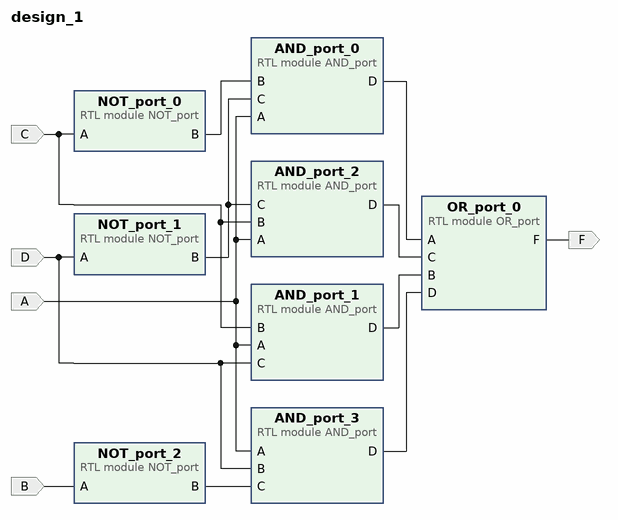
[diagram p0: block diagram of the top level]
# Vivado block design design_1, xc7z020clg400-1, Vivado 2023.1
create_bd_design design_1

create_bd_port -dir I A
create_bd_port -dir I C
create_bd_port -dir I D
create_bd_port -dir I B
create_bd_port -dir O F

create_bd_cell -type module -reference AND_port AND_port_0
create_bd_cell -type module -reference AND_port AND_port_1
create_bd_cell -type module -reference AND_port AND_port_2
create_bd_cell -type module -reference AND_port AND_port_3
create_bd_cell -type module -reference NOT_port NOT_port_0
create_bd_cell -type module -reference NOT_port NOT_port_1
create_bd_cell -type module -reference NOT_port NOT_port_2
create_bd_cell -type module -reference OR_port OR_port_0

# ---- connections ----

connect_bd_net [get_bd_pins AND_port_0/D] [get_bd_pins OR_port_0/A]
connect_bd_net [get_bd_pins AND_port_1/D] [get_bd_pins OR_port_0/B]
connect_bd_net [get_bd_pins AND_port_2/D] [get_bd_pins OR_port_0/C]
connect_bd_net [get_bd_pins AND_port_3/D] [get_bd_pins OR_port_0/D]
connect_bd_net -net A_0_2 [get_bd_ports B] [get_bd_pins NOT_port_2/A]
connect_bd_net [get_bd_ports A] [get_bd_pins AND_port_0/A] [get_bd_pins AND_port_1/A] [get_bd_pins AND_port_2/A] [get_bd_pins AND_port_3/A]
connect_bd_net [get_bd_ports C] [get_bd_pins NOT_port_0/A] [get_bd_pins AND_port_1/B] [get_bd_pins AND_port_2/B]
connect_bd_net [get_bd_ports D] [get_bd_pins NOT_port_1/A] [get_bd_pins AND_port_1/C] [get_bd_pins AND_port_3/B]
connect_bd_net [get_bd_pins NOT_port_0/B] [get_bd_pins AND_port_0/B]
connect_bd_net [get_bd_pins NOT_port_1/B] [get_bd_pins AND_port_0/C] [get_bd_pins AND_port_2/C]
connect_bd_net [get_bd_pins NOT_port_2/B] [get_bd_pins AND_port_3/C]
connect_bd_net [get_bd_pins OR_port_0/F] [get_bd_ports F]

validate_bd_design
save_bd_design
